# EAGLE design xbee-logger (EAGLE 5.03)
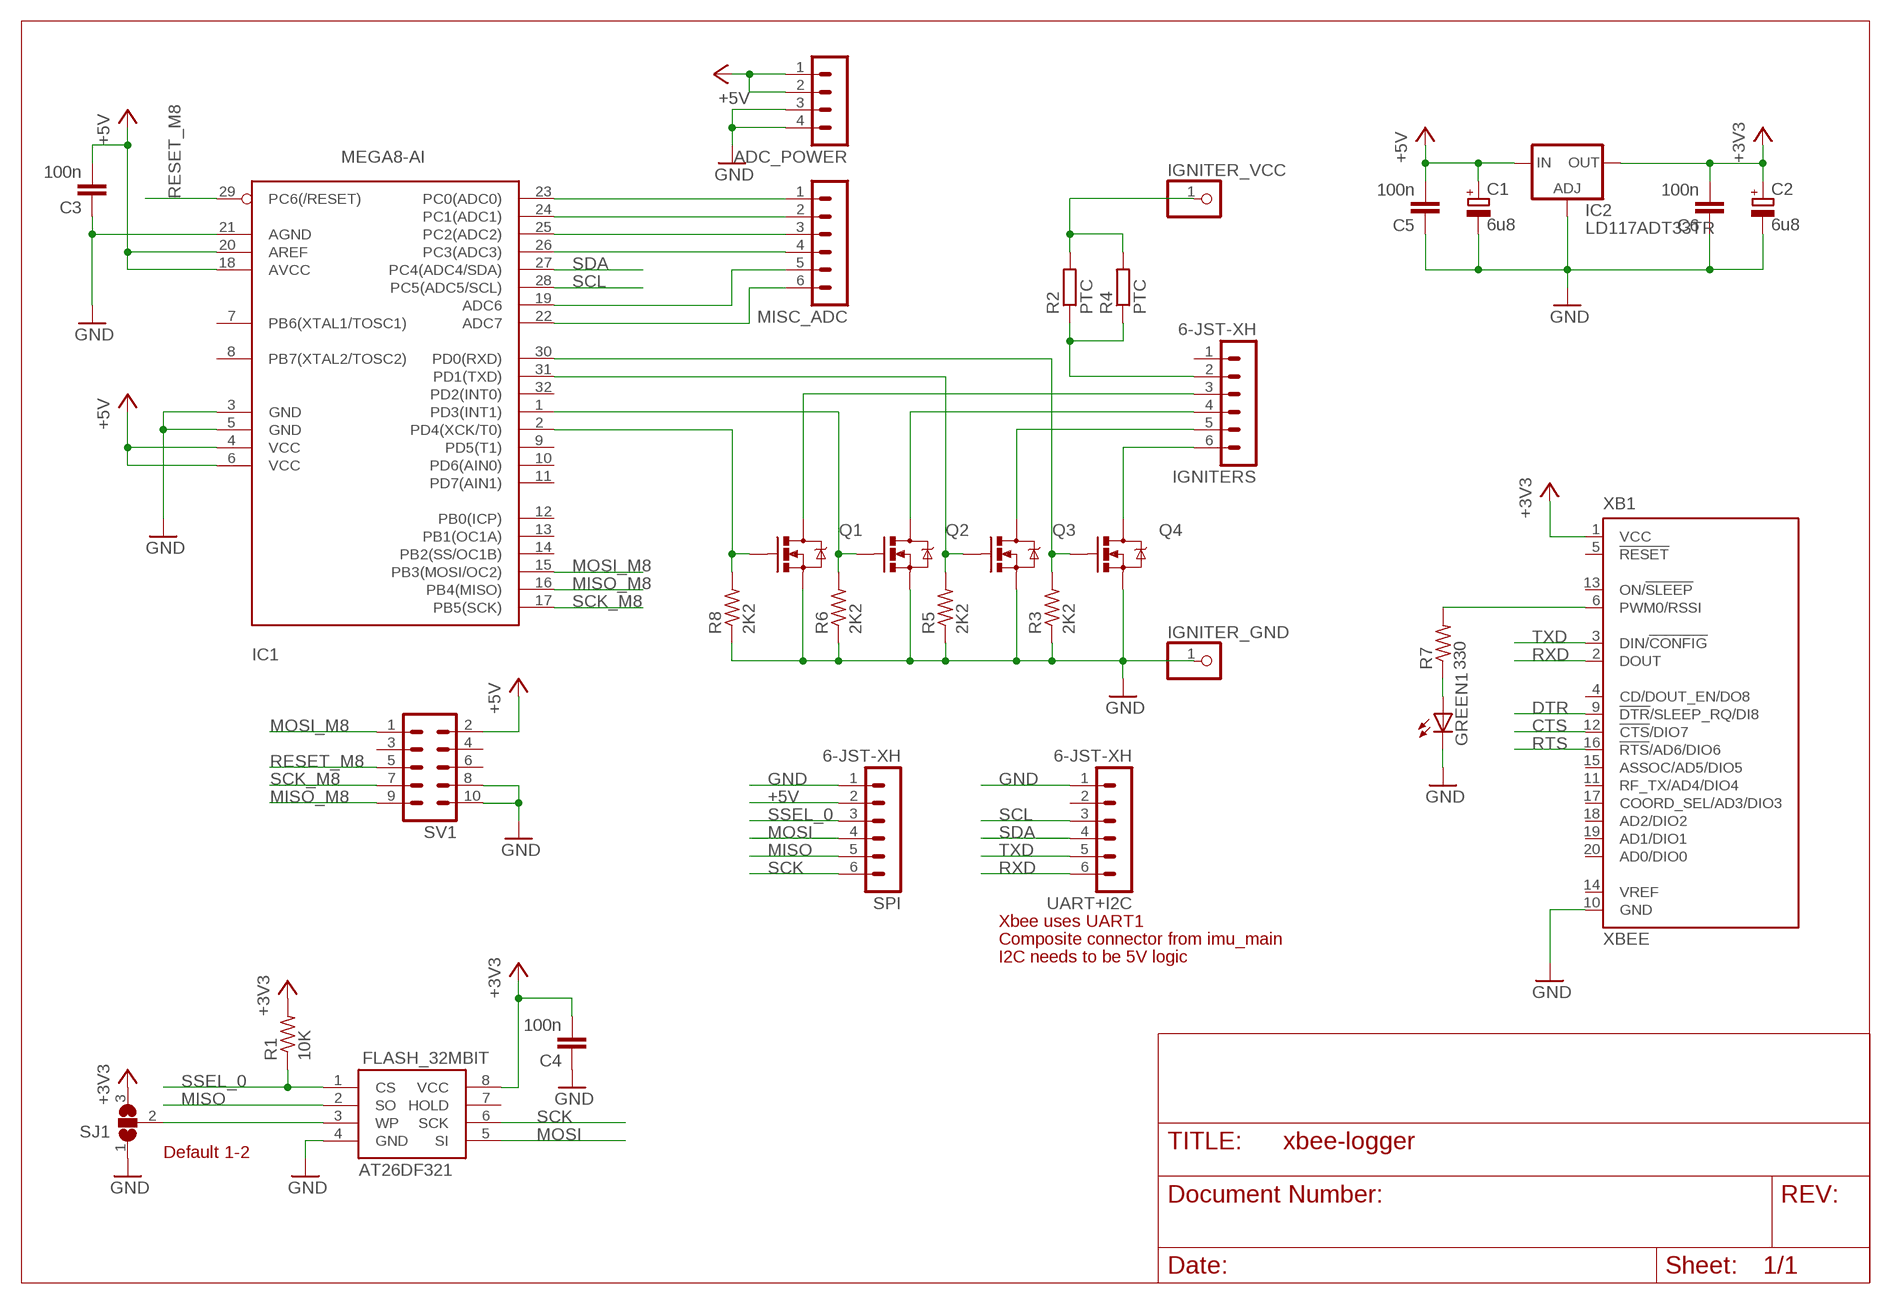
[diagram p0: schematic, sheet 1]

## Parts
ADC_POWER  MA04-1MA04-1  [MA04-1]
C1  6u8  CPOL-EUSMCA  [SMC_A]
C2  6u8  CPOL-EUSMCA  [SMC_A]
C3  100n  C-EUC0805  [C0805]
C4  100n  C-EUC0805  [C0805]
C5  100n  C-EUC0805  [C0805]
C6  100n  C-EUC0805  [C0805]
FLASH_32MBIT  AT26DF321  FLASH_SPI  [SO08]
GREEN1  LEDSMT1206  [1206]
IC1  MEGA8-AI  [TQFP32-08]
IC2  LD117ADT33TR  [DPACK]
IGNITER_GND  PINHD-1X1  [1X01]
IGNITER_VCC  PINHD-1X1  [1X01]
IGNITERS  6-JST-XH  [6]
MISC_ADC  MA06-1  [MA06-1]
Q1  MOSFET-NCHANNELSMD  [SOT23-3]
Q2  MOSFET-NCHANNELSMD  [SOT23-3]
Q3  MOSFET-NCHANNELSMD  [SOT23-3]
Q4  MOSFET-NCHANNELSMD  [SOT23-3]
R1  10K  R-US_R0805  [R0805]
R2  PTC  R-EU_R2512  [R2512]
R3  2K2  R-US_R0805  [R0805]
R4  PTC  R-EU_R2512  [R2512]
R5  2K2  R-US_R0805  [R0805]
R6  2K2  R-US_R0805  [R0805]
R7  330  R-US_R0805  [R0805]
R8  2K2  R-US_R0805  [R0805]
SJ1  SOLDERJUMPER_2WAYW  [SJ_2W]
SPI  6-JST-XH  [6]
SV1  MA05-2LARGE_PAD  [MA05-2A]
UART+I2C  6-JST-XH  [6]
XB1  XBEE  [XBEE-PRO2]

## Nets
+3V3: C2.+ C4.2 C6.2 FLASH_32MBIT.8(VCC) IC2.4(OUT) R1.2 SJ1.3 XB1.1(VCC)
+5V: ADC_POWER.1 ADC_POWER.2 C1.+ C3.2 C5.2 IC1.4(VCC) IC1.6(VCC) IC1.18(AVCC) IC1.20(AREF) IC2.3(IN) SPI.2 SV1.2
CTS: XB1.12(!CTS!/DIO7)
DTR: XB1.9(!DTR!/SLEEP_RQ/DI8)
GND: ADC_POWER.3 ADC_POWER.4 C1.- C2.- C3.1 C4.1 C5.1 C6.1 FLASH_32MBIT.4(GND) GREEN1.C IC1.3(GND) IC1.5(GND) IC1.21(AGND) IC2.1(ADJ) IGNITER_GND.1 Q1.2(S) Q2.2(S) Q3.2(S) Q4.2(S) R3.1 R5.1 R6.1 R8.1 SJ1.1 SPI.1 SV1.8 SV1.10 UART+I2C.1 XB1.10(GND)
MISO: FLASH_32MBIT.2(SO) SPI.5
MISO_M8: IC1.16(PB4(MISO)) SV1.9
MOSI: FLASH_32MBIT.5(SI) SPI.4
MOSI_M8: IC1.15(PB3(MOSI/OC2)) SV1.1
N$1: FLASH_32MBIT.3(WP) SJ1.2
N$2: IGNITERS.3 Q1.3(D)
N$3: IGNITERS.4 Q2.3(D)
N$4: IGNITERS.5 Q3.3(D)
N$5: IGNITERS.6 Q4.3(D)
N$6: IC1.2(PD4(XCK/T0)) Q1.1(G) R8.2
N$7: IC1.1(PD3(INT1)) Q2.1(G) R6.2
N$8: IC1.31(PD1(TXD)) Q3.1(G) R5.2
N$9: IC1.30(PD0(RXD)) Q4.1(G) R3.2
N$10: IC1.23(PC0(ADC0)) MISC_ADC.1
N$11: IGNITERS.2 R2.1 R4.1
N$12: IGNITER_VCC.1 R2.2 R4.2
N$13: GREEN1.A R7.1
N$14: IC1.24(PC1(ADC1)) MISC_ADC.2
N$15: R7.2 XB1.6(PWM0/RSSI)
N$16: IC1.25(PC2(ADC2)) MISC_ADC.3
N$17: IC1.26(PC3(ADC3)) MISC_ADC.4
N$18: IC1.19(ADC6) MISC_ADC.5
N$19: IC1.22(ADC7) MISC_ADC.6
RESET_M8: IC1.29(PC6(/RESET)) SV1.5
RTS: XB1.16(!RTS!/AD6/DIO6)
RXD: UART+I2C.6 XB1.2(DOUT)
SCK: FLASH_32MBIT.6(SCK) SPI.6
SCK_M8: IC1.17(PB5(SCK)) SV1.7
SCL: IC1.28(PC5(ADC5/SCL)) UART+I2C.3
SDA: IC1.27(PC4(ADC4/SDA)) UART+I2C.4
SSEL_0: FLASH_32MBIT.1(CS) R1.1 SPI.3
TXD: UART+I2C.5 XB1.3(DIN/!CONFIG)
Unconnected: FLASH_32MBIT.7(HOLD) IC1.7(PB6(XTAL1/TOSC1)) IC1.8(PB7(XTAL2/TOSC2)) IC1.9(PD5(T1)) IC1.10(PD6(AIN0)) IC1.11(PD7(AIN1)) IC1.12(PB0(ICP)) IC1.13(PB1(OC1A)) IC1.14(PB2(SS/OC1B)) IC1.32(PD2(INT0)) IGNITERS.1 SV1.3 SV1.4 SV1.6 UART+I2C.2 XB1.4(CD/DOUT_EN/DO8) XB1.5(!RESET) XB1.11(RF_TX/AD4/DIO4) XB1.13(ON/!SLEEP) XB1.14(VREF) XB1.15(ASSOC/AD5/DIO5) XB1.17(COORD_SEL/AD3/DIO3) XB1.18(AD2/DIO2) XB1.19(AD1/DIO1) XB1.20(AD0/DIO0)

## Notes on the sheet
- Xbee uses UART1
- Composite connector from imu_main
- I2C needs to be 5V logic
- Default 1-2

## Library data of the parts
ADC_POWER = con-lstb:MA04-1: PIN HEADER
C1 C2 = rcl:CPOL-EU: POLARIZED CAPACITOR, European symbol
C3-C6 = rcl:C-EU: CAPACITOR, European symbol
FLASH_32MBIT = SparkFun:FLASH_SPI
GREEN1 = led:LED: LED OSRAM: - CHIPLED LG R971, LG N971, LY N971, LG Q971, LY Q971, LO R971, LY R971 LH N974, LH R974 LS Q976, LO Q976, LY Q976 LO Q996 - Hyper CHIPLED LW Q18S LB Q993, LB Q99A, LB R99A - SideLED LS A670, LO A670, LY A670, LG A670, LP A670 LB A673, LV A673, LT A673, LW A673 LH A674 LY A675 LS A676, LA A676, LO A676, LY A676, LW A676 LS A679, LY A679, LG A679 - Hyper Micro SIDELED® LS Y876, LA Y876, LO Y876, LY Y876 LT Y87S - SmartLED LW L88C, LW L88S LB L89C, LB L89S, LG L890 LS L89K, LO L89K, LY L89K LS L896, LA L896, LO L896, LY L896 - TOPLED LS T670, LO T670, LY T670, LG T670, LP T670 LSG T670, LSP T670, LSY T670, LOP T670, LYG T670 LG T671, LOG T671, LSG T671 LB T673, LV T673, LT T673, LW T673 LH T674 LS T676, LA T676, LO T676, LY T676, LB T676, LH T676, LSB T676, LW T676 LB T67C, LV T67C, LT T67C, LS T67K, LO T67K, LY T67K, LW E67C LS E67B, LA E67B, LO E67B, LY E67B, LB E67C, LV E67C, LT E67C LW T67C LS T679, LY T679, LG T679 LS T770, LO T770, LY T770, LG T770, LP T770 LB T773, LV T773, LT T773, LW T773 LH T774 LS E675, LA E675, LY E675, LS T675 LS T776, LA T776, LO T776, LY T776, LB T776 LHGB T686 LT T68C, LB T68C - Hyper Mini TOPLED® LB M676 - Mini TOPLED Santana® LG M470 LS M47K, LO M47K, LY M47K Source: http://www.osram.convergy.de LUXEON: - LUMILED® LXK2-PW12-R00, LXK2-PW12-S00, LXK2-PW14-U00, LXK2-PW14-V00 LXK2-PM12-R00, LXK2-PM12-S00, LXK2-PM14-U00 LXK2-PE12-Q00, LXK2-PE12-R00, LXK2-PE12-S00, LXK2-PE14-T00, LXK2-PE14-U00 LXK2-PB12-K00, LXK2-PB12-L00, LXK2-PB12-M00, LXK2-PB14-N00, LXK2-PB14-P00, LXK2-PB14-Q00 LXK2-PR12-L00, LXK2-PR12-M00, LXK2-PR14-Q00, LXK2-PR14-R00 LXK2-PD12-Q00, LXK2-PD12-R00, LXK2-PD12-S00 LXK2-PH12-R00, LXK2-PH12-S00 LXK2-PL12-P00, LXK2-PL12-Q00, LXK2-PL12-R00 Source: www.luxeon.com KINGBRIGHT: KA-3528ASYC Source: www.kingbright.com
IC1 = atmel:MEGA8: MICROCONTROLLER 8 Kbytes FLASH, 1 kbytes SRAM, 512 bytes EEPROM, USART, 6-channel 10 bit ADC, 2-channel 8 bit ADC Pin compatible with Atmega48, ATMega88, ATMega168 Source: avr.lbr
IC2 = v-reg:LD117A?*: Low drop fixed and adjustable positive voltage regulators 1 A Source: http://www.st.com/stonline/products/literature/ds/7194/ld1117axx.pdf
IGNITER_GND IGNITER_VCC = pinhead:PINHD-1X1: PIN HEADER
IGNITERS SPI UART+I2C = con-jst-xh:6-JST-XH
MISC_ADC = con-lstb:MA06-1: PIN HEADER
Q1-Q4 = SparkFun:MOSFET-NCHANNEL
R1 R3 R5-R8 = rcl:R-US_: RESISTOR, American symbol
R2 R4 = rcl:R-EU_: RESISTOR, European symbol
SJ1 = SparkFun:SOLDERJUMPER_2WAY: Solder Jumper 2 way solder jumper
SV1 = con-lstb:MA05-2: PIN HEADER
XB1 = maxstream:XBEE: XBee (TM) /XBee-PRO(TM) OEM RF Modules Source: MaxStream, Inc. xbee_productmanual.pdf

## Board
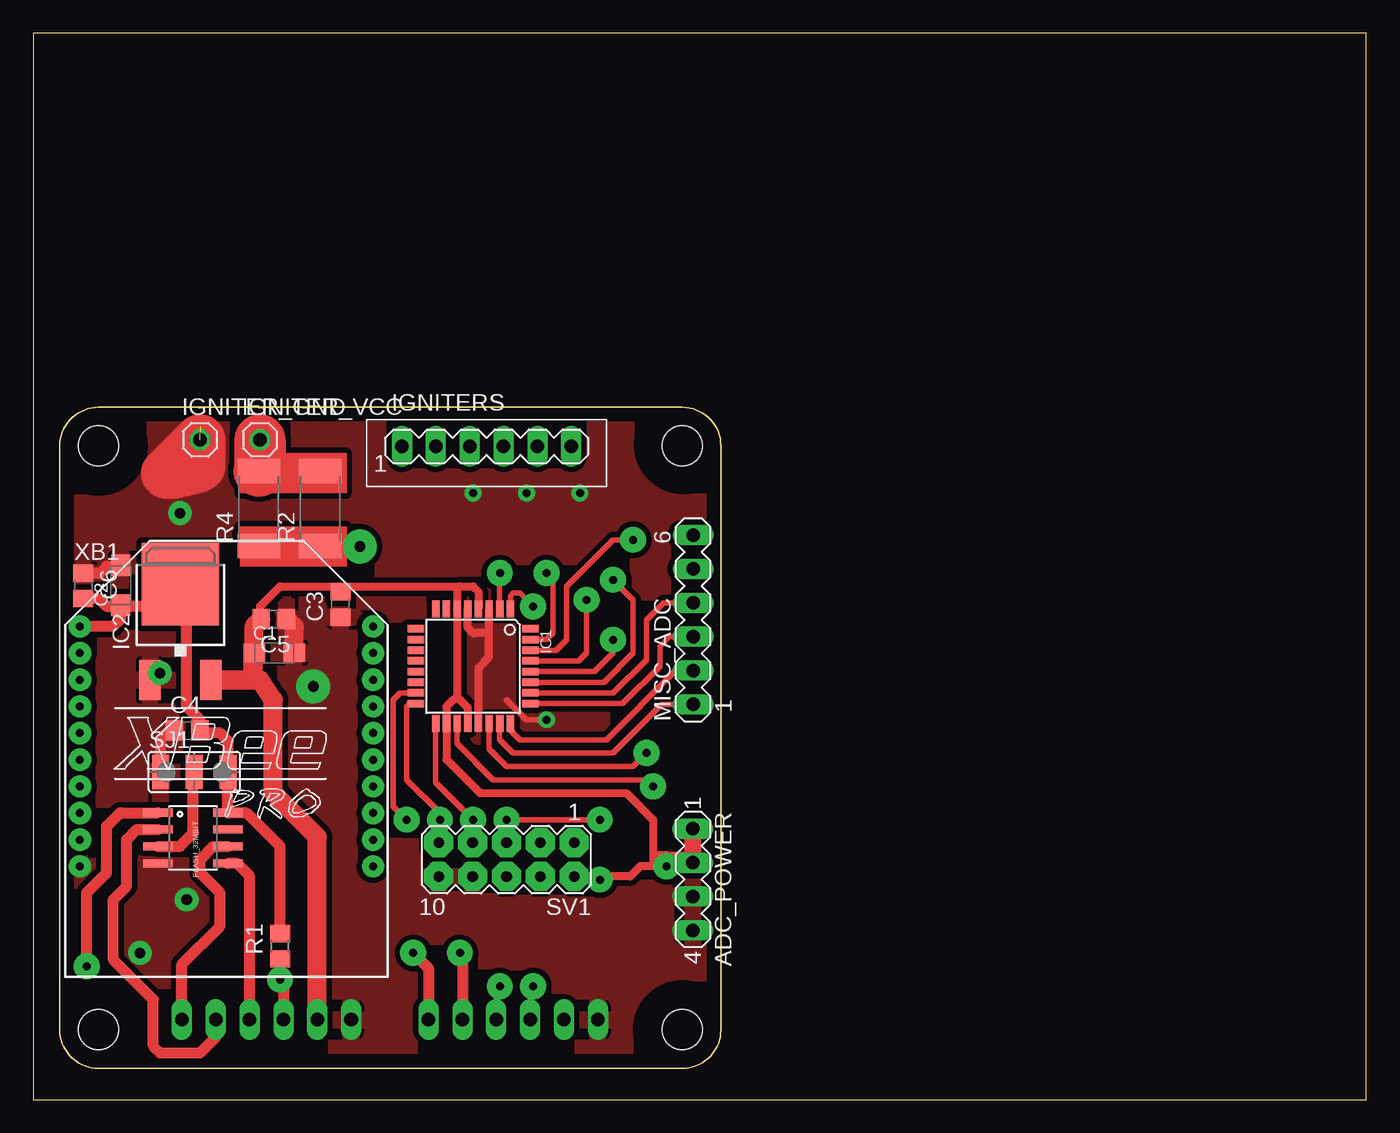
[diagram p1: board, top side]
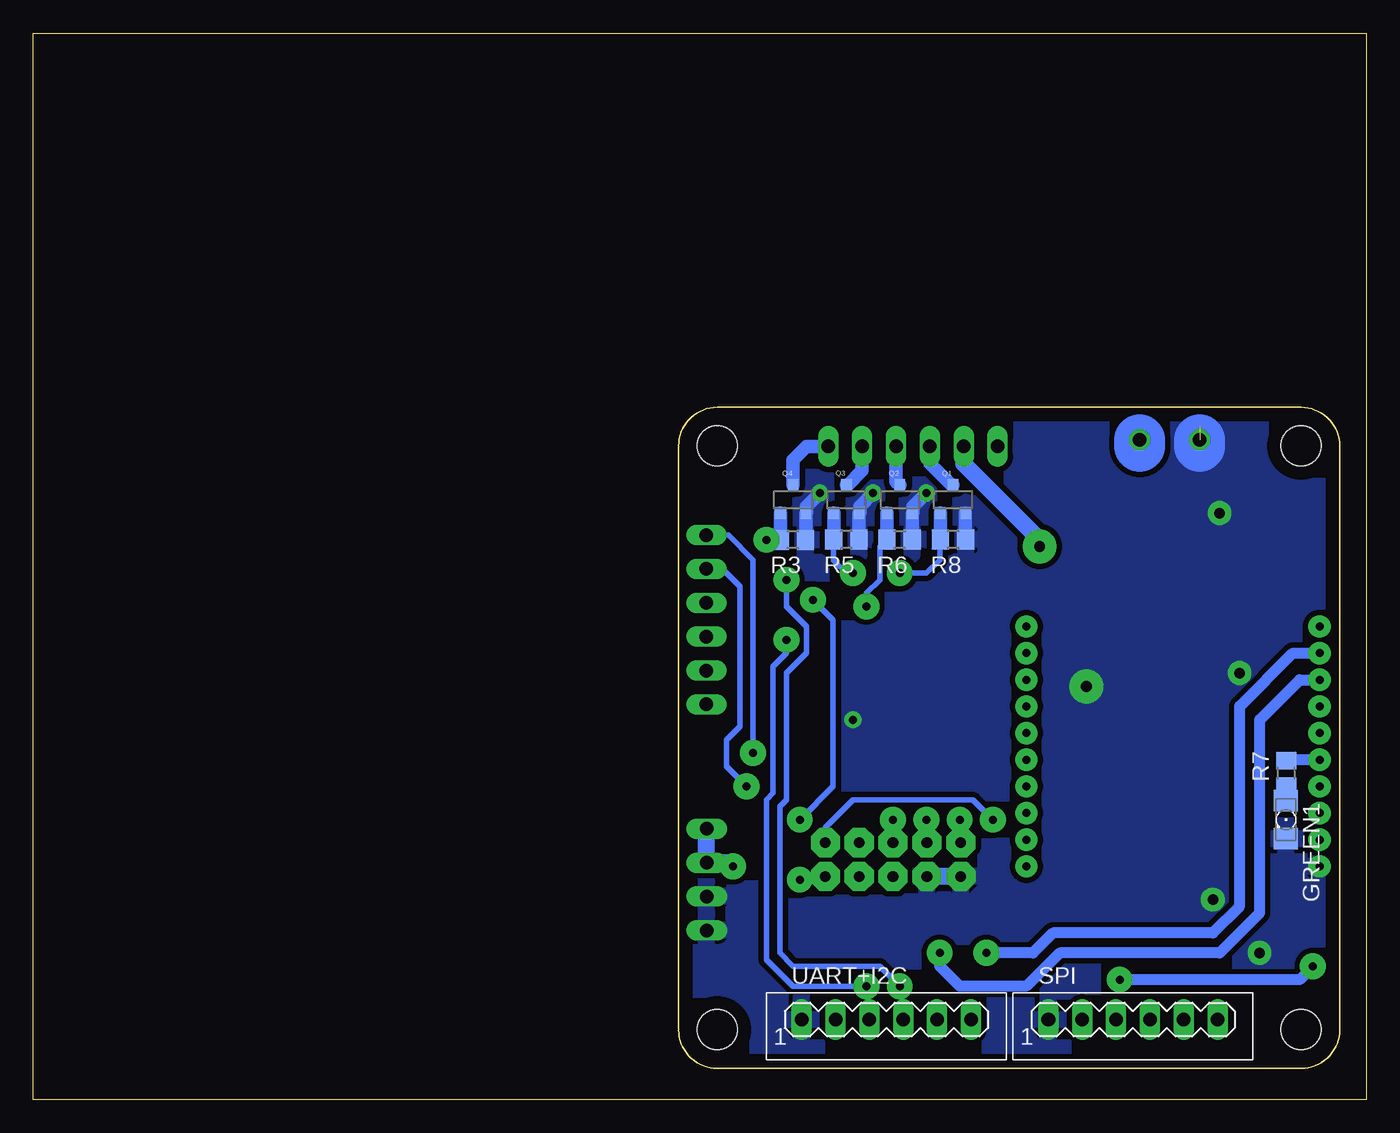
[diagram p2: board, bottom side, seen from below]

Size 100 x 80 mm. Coordinates in mm from the lower left corner, seen from the top.
Outline: 0,0 100,0 100,80 0,80 0,0
Outline: 1.99,5.24 1.99,49.04 arc-90 4.89,51.94 48.69,51.94 arc-90 51.59,49.04 51.59,5.24 arc-90 48.69,2.34 4.89,2.34 arc-90 1.99,5.24
Copper layers (1*16): Top 0.035mm / dielectric 1.5mm / Bottom 0.035mm
Design rules "default": minimum track width 10mil, minimum drill 24mil, track to track 8mil, track to pad 8mil, pad to pad 8mil, via to via 8mil, smd to smd 8mil, copper to edge 40mil, drill to drill 8mil, minimum pad ring 10mil, minimum via ring 8mil, stop-mask expansion 4mil, vias tented up to drill 0mil, thermal gap 10mil
Holes 3 mm at 4.89,49.04 48.69,49.04 4.89,5.24 48.69,5.24
tRestrict: area 1.8,45.9 to 8,52.1; area 45.7,46 to 51.9,52.2; area 45.6,2.1 to 51.8,8.3; area 1.8,2.1 to 8,8.3

### Footprints (pad centres in the part's own frame; a part is rotated, then mirrored left to right if it is on the bottom)
MA04-1 = drill 1.016 long: 1 -3.81,0; 2 -1.27,0; 3 1.27,0; 4 3.81,0
SMC_A = smd 1.6 x 1.4: + -1.5,0; - 1.5,0
C0805 = smd 1.3 x 1.5: 1 -0.95,0; 2 0.95,0
SO08 = smd 0.61 x 2.21: 1 -1.905,-2.616; 2 -0.635,-2.616; 3 0.635,-2.616; 4 1.905,-2.616; 5 1.905,2.616; 6 0.635,2.616; 7 -0.635,2.616; 8 -1.905,2.616
1206 = smd 1.6 x 1.803: A -1.422,0; C 1.422,0
TQFP32-08 = smd 1.27 x 0.559: 1 -4.293,2.8; 2 -4.293,2; 3 -4.293,1.2; 4 -4.293,0.4; 5 -4.293,-0.4; 6 -4.293,-1.2; 7 -4.293,-2; 8 -4.293,-2.8; 17 4.293,-2.8; 18 4.293,-2; 19 4.293,-1.2; 20 4.293,-0.4; 21 4.293,0.4; 22 4.293,1.2; 23 4.293,2; 24 4.293,2.8 | smd 0.559 x 1.27: 9 -2.8,-4.293; 10 -2,-4.293; 11 -1.2,-4.293; 12 -0.4,-4.293; 13 0.4,-4.293; 14 1.2,-4.293; 15 2,-4.293; 16 2.8,-4.293; 25 2.8,4.293; 26 2,4.293; 27 1.2,4.293; 28 0.4,4.293; 29 -0.4,4.293; 30 -1.2,4.293; 31 -2,4.293; 32 -2.8,4.293
DPACK = smd 1.6 x 3: 1 -2.28,-4.8; 3 2.28,-4.8 | smd 5.8 x 6.2: 4 0,2.38
1X01 = drill 1.016 octagon: 1 0,0
6 = drill 1.016 long: 1 -6.35,0; 2 -3.81,0; 3 -1.27,0; 4 1.27,0; 5 3.81,0; 6 6.35,0
MA06-1 = drill 1.016 long: 1 -6.35,0; 2 -3.81,0; 3 -1.27,0; 4 1.27,0; 5 3.81,0; 6 6.35,0
SOT23-3 = smd 0.8 x 0.9: 1 -0.95,-1; 2 0.95,-1; 3 0,1.1
R0805 = smd 1.3 x 1.5: 1 -0.95,0; 2 0.95,0
R2512 = smd 1.8 x 3.2: 1 -2.8,0; 2 2.8,0
SJ_2W = smd 1.27 x 2.54: 1 -2.54,0; 2 0,0; 3 2.54,0
MA05-2A = drill 0.8 pad 2.184 octagon: 1 -5.08,-1.27; 2 -5.08,1.27; 3 -2.54,-1.27; 4 -2.54,1.27; 5 0,-1.27; 6 0,1.27; 7 2.54,-1.27; 8 2.54,1.27; 9 5.08,-1.27; 10 5.08,1.27
XBEE-PRO2 = drill 0.6 pad 1.676 round: 1 -11,9; 2 -11,7; 3 -11,5; 4 -11,3; 5 -11,1; 6 -11,-1; 7 -11,-3; 8 -11,-5; 9 -11,-7; 10 -11,-9; 11 11,-9; 12 11,-7; 13 11,-5; 14 11,-3; 15 11,-1; 16 11,1; 17 11,3; 18 11,5; 19 11,7; 20 11,9

### Placement (x,y rotation side)
ADC_POWER  49.49,16.5 270 top
C1  18.08,33.52 0 top
C2  6.56,38.58 90 top
C3  23.04,37.14 90 top
C4  11.54,27.69 0 top
C5  18.04,36.05 180 top
C6  3.76,38.54 270 top
FLASH_32MBIT  11.98,19.62 270 top
GREEN1  6.01,20.99 270 bottom
IC1  32.99,32.51 270 top
IC2  11.04,36.28 0 top
IGNITER_GND  12.5,49.5 0 top
IGNITER_VCC  17,49.5 0 top
IGNITERS  34.01,49 0 top
MISC_ADC  49.5,36 90 top
Q1  31.01,45 0 bottom
Q2  34.99,45 0 bottom
Q3  38.99,45 0 bottom
Q4  43,45 0 bottom
R1  18.5,11.51 90 top
R2  21.53,44.34 90 top
R3  43.02,42 180 bottom
R4  16.92,44.34 90 top
R5  39,42.01 180 bottom
R6  35.01,42 180 bottom
R7  6,24.48 90 bottom
R8  31,42.01 180 bottom
SJ1  12.08,24.57 0 top
SPI  17.49,6 0 bottom
SV1  35.5,18 180 top
UART+I2C  36,6 0 bottom
XB1  14.5,26.5 0 top

### Tracks (layer width: path | path; a pad name or v marks a point on that pad's centre or on a via)
+3V3
  Top 0.813: 11.5,37 11.5,29.5 12.49,28.51 C4.2 13.18,27.5 14,27.5 14.62,26.88 SJ1.3 14.6,24.55 FLASH_32MBIT.8 14.62,21.5 16,21.5 18.5,19 R1.2 | 11.5,37 11.5,39.12 IC2.4 | XB1.1 6,35.5 6.5,36 6.5,37.02 C2.+ 6.48,37 5.5,37 | C6.2 4.91,37.59 5.5,37 | 11.5,37 5.5,37
+5V  (via drill 0.6 pad 1.93)
  Top 0.406: 30.99,29.49 IC1.18 | 32,30 31.5,30
  Top 0.61: 31.5,30 30.99,29.49 30.99,25.51 33.5,23 44.5,23 46.5,21 46.5,17.5 v47.5,17.5 45.53,17.5 44.77,16.73 42.73,16.73 v42.5,16.5 | IC1.20 32.59,29.41 32,30 31.79,30.21 IC1.6 31.79,38.29 32,38.5 | IC1.4 33.39,38.11 33,38.5 32,38.5 | 23,38.5 18.5,38.5 17,37 17,36.14 C5.2 | 23,38.5 32,38.5 | C3.2 23.04,38.46 23,38.5
  Top 1.27: ADC_POWER.2 ADC_POWER.1 | v47.5,17.5 47.5,18 47,18 49.5,18
  Top 1.422: SPI.2 21.3,19.7 18,23 18,30 17,31.5 14.84,31.5 IC2.3 16.48,31.48 16.5,32.5 16.5,33.44 C1.+ 16.58,35.54 C5.2
  Bottom 0.61: SV1.2 42.27,16.73 v42.5,16.5
  Bottom 1.27: 49.5,20 49.49,20 ADC_POWER.2 47.5,17.77 v47.5,17.5
GND  (via drill 0.6 pad 1.27, 0.8 pad 1.78, 0.8 pad 2.54)  (2 unrouted)
  Top 0.406: 35.5,30 37,28.5 v38.5,28.5
  Top 0.61: IC1.21 33.39,32.39 34.19,33.19 34.19,35 | 34.19,35 IC1.3 | IC1.5 32.59,35.41 33,35 34.19,35 | v9.5,32 8.98,31.48 IC2.1
  Top 0.813: SJ1.1 9.54,27.04 10,27.5 10.4,27.5 C4.1 | C6.1 4.99,39.49 5.5,40 6.48,40 C2.-
  Top 1.422: C1.- 19.58,35.46 C5.1
  Top 3.81: 12.5,47.5 IGNITER_GND.1 | 12.5,47.5 10.5,47 10,47 12,49 12.5,47.5
  Bottom 1.016: Q1.2 R8.1 | R6.1 34.04,42.01 Q2.2 34,44.05 34,44.5 v33,45.5 | R5.1 Q3.2 38,44.04 38,44.5 v37,45.5 | R3.1 42.05,42.02 Q4.2 42,44.04 42,44.5 v41,45.5 | 12.5,50.5 13.5,50.5
  Bottom 1.27: SV1.10 SV1.8
  Bottom 3.81: 12.5,49 IGNITER_GND.1
  other vias: 21,31 11.5,15 8,11 11,44
  pour Top (isolate 0.406): 2.5,3 51,3 51,51.5 2.5,51.5
  pour Bottom (isolate 0.406): 3,3 51,3 51,51.5 2.5,51.5 2.5,3
MISO
  Top 0.813: SPI.5 13.68,4.68 12.5,3.5 9.5,3.5 9,4 9,7.5 6,10.5 6,15 7,16 7,17 7,19.5 7.75,20.25 FLASH_32MBIT.2
MISO_M8  (via drill 0.6 pad 1.93)
  Top 0.406: IC1.16 28.21,29.71 28,29.5 28,24 30.5,21.5 v30.5,21
  Bottom 0.406: SV1.9 30.42,20.92 v30.5,21
MOSI
  Top 0.813: FLASH_32MBIT.5 15.29,17.71 16.22,16.78 SPI.4
MOSI_M8  (via drill 0.6 pad 1.93)
  Top 0.406: IC1.15 27.51,30.51 27,30 27,22 v28,21
  Bottom 0.406: SV1.1 40.58,20.42 38.5,22.5 29.5,22.5 v28,21
N$1
  Top 0.813: FLASH_32MBIT.3 10.98,18.98 12,20 12,24.49 SJ1.2
N$2
  Bottom 1.016: IGNITERS.3 32.73,47.73 31.1,46.1 Q1.3
N$3
  Bottom 1.016: IGNITERS.4 35.27,46.39 Q2.3
N$4
  Bottom 1.016: IGNITERS.5 37.81,47.19 38.9,46.1 Q3.3
N$5
  Bottom 1.016: IGNITERS.6 42,49 43,48 Q4.3
N$6  (via drill 0.6 pad 1.93)
  Top 0.406: IC1.2 v34.99,39.49 v35,39.5
  Bottom 0.406: v35,39.5 33,39.5 32,40.5 32,41.95 R8.2
  Bottom 1.016: Q1.1 R8.2
N$7  (via drill 0.6 pad 1.93)
  Top 0.406: IC1.1 35.79,37.79 36,38 36.5,38 v37.5,37
  Bottom 0.406: v37.5,37 37.5,38 36.5,39 36.5,41.5 36,41.96 R6.2
  Bottom 1.016: R6.2 35.96,43.99 Q2.1
N$8  (via drill 0.6 pad 1.93)
  Top 0.406: IC1.31 38.51,34.51 39,35 39,39 v38.5,39.5
  Bottom 0.406: v38.5,39.5 39,39.5 39.95,40.45 R5.2
  Bottom 1.016: Q3.1 R5.2
N$9  (via drill 0.6 pad 1.93)
  Top 0.406: IC1.30 39.21,33.71 40,34.5 40,38.5 43.5,42 v45,42
  Bottom 0.406: v45,42 R3.2
  Bottom 1.016: Q4.1 43.95,42.02 R3.2
N$10
  Top 0.406: IC1.23 34.99,27.01 36,26 43.5,26 47.15,29.65 MISC_ADC.1
N$11  (via drill 0.8 pad 2.54)
  Top 1.27: v24.5,41.5 21.57,41.5 R2.1
  Top 1.422: R4.1 R2.1
  Bottom 1.27: IGNITERS.2 30.2,47.7 24.5,42 v24.5,41.5
N$12  (1 unrouted)
  Top 1.422: R4.2 R2.2
  Top 3.81: 17,47.5 IGNITER_VCC.1 17,47.22 R4.2
  Bottom 3.81: 17,49 IGNITER_VCC.1
N$13
  Bottom 0.813: R7.1 6,22.43 GREEN1.A
N$14
  Top 0.406: MISC_ADC.2 48.19,32.19 43,27 36.5,27 35.79,27.71 IC1.24
N$15
  Bottom 0.813: XB1.6 5.94,25.5 R7.2
N$16
  Top 0.406: IC1.25 44.21,29.71 47,32.5 47,34 47.73,34.73 MISC_ADC.3
N$17
  Top 0.406: IC1.26 43.51,30.51 46,33 46,36 47.27,37.27 MISC_ADC.4
N$18  (via drill 0.6 pad 1.93)
  Top 0.406: IC1.19 31.79,26.71 34.5,24 46,24 v46.5,23.5
  Bottom 0.406: v46.5,23.5 48,25 48,27 47,28 47,38.5 48.31,39.81 MISC_ADC.5
N$19  (via drill 0.6 pad 1.93)
  Top 0.406: IC1.22 34.19,26.31 35.5,25 45,25 v46,26
  Bottom 0.406: v46,26 46,40.5 47.85,42.35 MISC_ADC.6
RESET_M8  (via drill 0.6 pad 1.93)
  Top 0.406: IC1.29 40.91,32.91 41.5,33.5 v41.5,37.5 | v35.5,21 v42.5,21
  Bottom 0.406: v41.5,37.5 40,36 40,23.5 v42.5,21 | SV1.5 v35.5,21 | SV1.5
RXD  (via drill 0.6 pad 1.93)
  Top 0.813: UART+I2C.6 29.65,9.85 v28.5,11
  Bottom 0.813: v28.5,11 25,11 23.5,12.5 11.5,12.5 9.5,14.5 9.5,29.5 5.5,33.5 XB1.2
SCK
  Top 0.813: SPI.6 11.14,10.14 14,13 14,15.5 12.5,17 12.5,18 13.48,18.98 FLASH_32MBIT.6
SCK_M8  (via drill 0.6 pad 1.93)
  Top 0.406: IC1.17 30.19,23.81 v33,21
  Bottom 0.406: SV1.7 32.96,20.96 v33,21
SCL  (via drill 0.6 pad 1.93)
  Top 0.406: IC1.28 42.11,32.11 43.5,33.5 v43.5,34.5 | UART+I2C.3 37.27,8.27 v37.5,8.5
  Bottom 0.406: v43.5,34.5 43.5,33.5 44.5,32.5 44.5,23 45,22.5 45,10.5 43,8.5 v37.5,8.5
SDA  (via drill 0.6 pad 1.93)
  Top 0.406: IC1.27 42.81,31.31 45,33.5 45,37.5 v43.5,39 | UART+I2C.4 34.73,8.23 v35,8.5
  Bottom 0.406: v43.5,39 43.5,37 42,35.5 42,33.5 43.5,32 43.5,22.5 44,22 44,11 43,10 36.5,10 v35,8.5
SSEL_0  (via drill 0.6 pad 1.93)
  Top 0.813: FLASH_32MBIT.1 6.53,21.52 5.5,20.5 5.5,17 4,15.5 v4,10 | SPI.3 18.76,8.74 v18.5,9 R1.1
  Bottom 0.813: v4,10 5,9 v18.5,9
TXD  (via drill 0.6 pad 1.93)
  Top 0.813: UART+I2C.5 32.19,10.31 v32,11
  Bottom 0.813: v32,11 32,10 30.5,8.5 25.5,8.5 23,11 11,11 8,14 8,28.5 5,31.5 XB1.3
(copper drawn outside any net)
  shapes: Top area x2